# EAGLE schematic Sensor module (EAGLE 9.3.1)
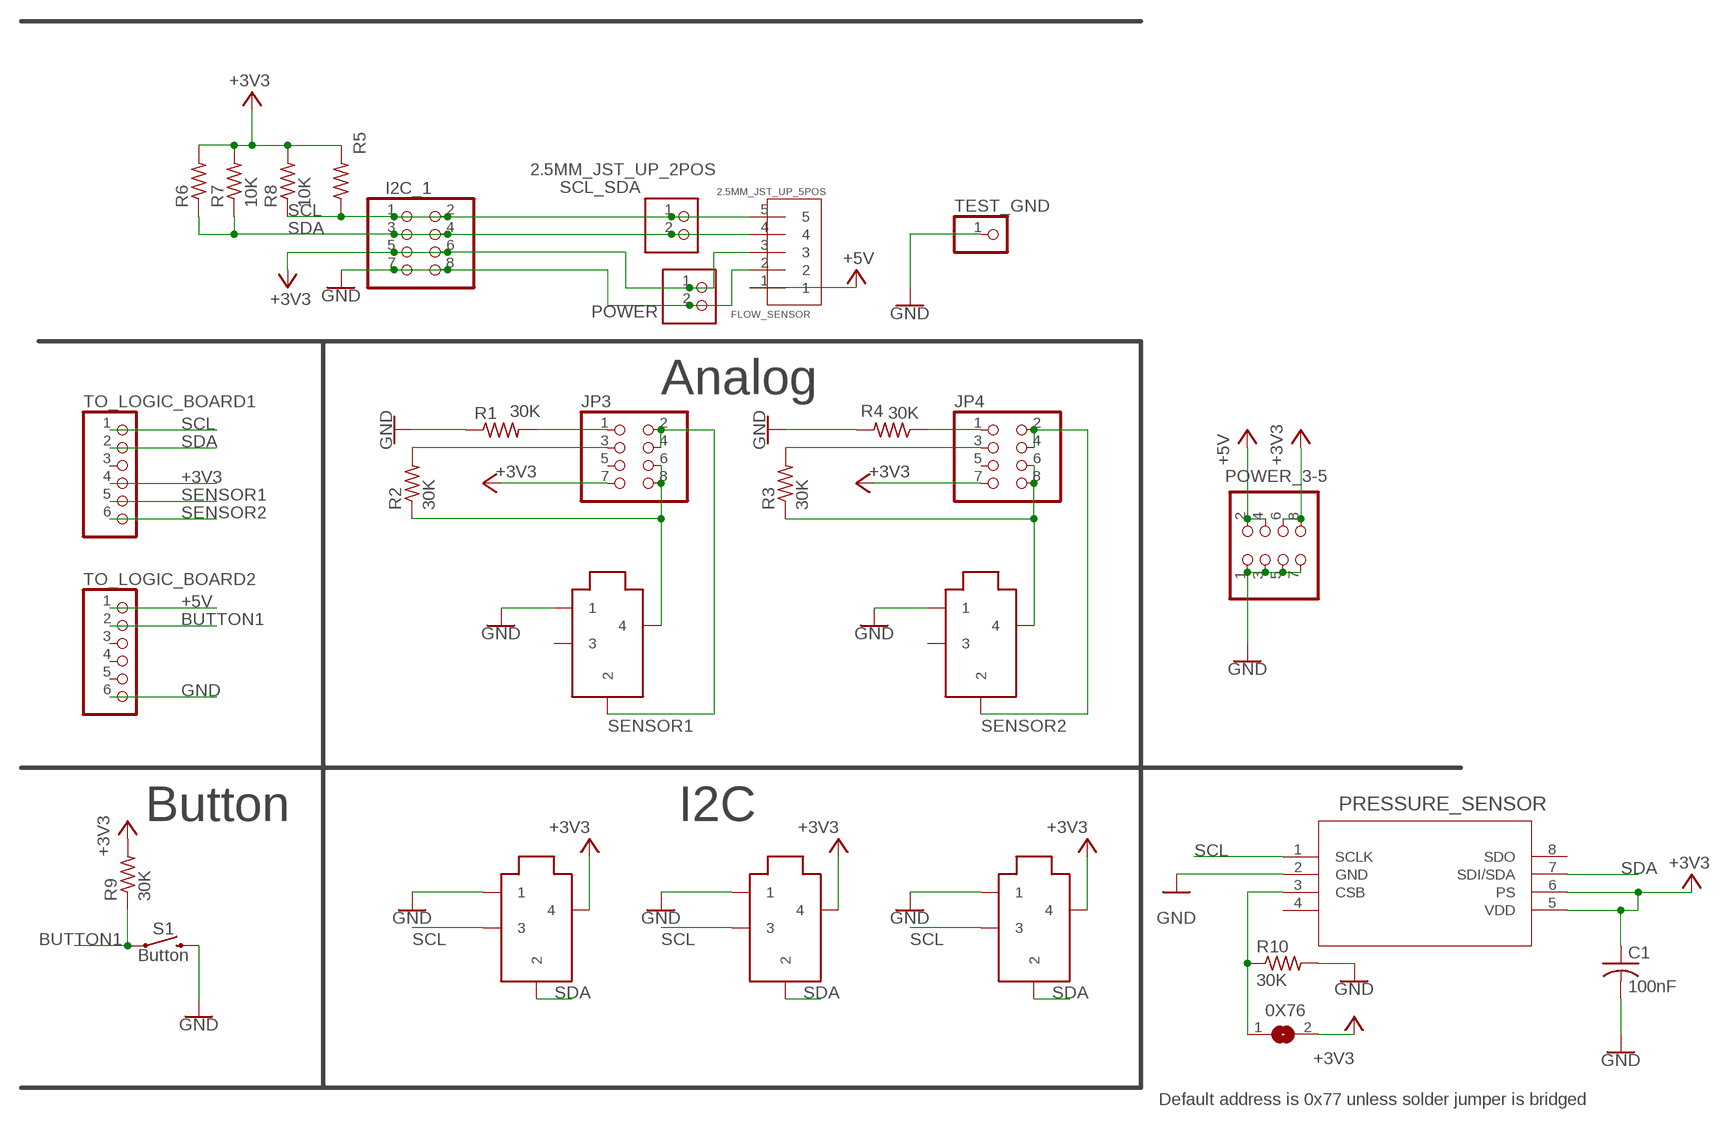
[diagram p0: schematic, sheet 1]

## Parts
0X76  SJ  [SJ]
ANALOG1  AUDIOJACK_2.5MM_SMD  [AJ_2.5_SMD]
ANALOG2  AUDIOJACK_2.5MM_SMD  [AJ_2.5_SMD]
C1  100nF  C-USC1206  [C1206]
FLOW_SENSOR  2.5MM_JST_UP_5POS  [JST_5POS_2.5MM_UP]
I2C_1  PINHD-2X4  [2X04]
JP3  PINHD-2X4  [2X04]
JP4  PINHD-2X4  [2X04]
POWER  2.5MM_JST_UP_2POS  [JST_2POS_2.5MM_UP]
POWER_3-5  PINHD-2X4  [2X04]
PRESSURE_SENSOR  MS580302BA01-00  [MS5803-02BA01]
R1  30K  R-US_R1206  [R1206]
R2  30K  R-US_R1206  [R1206]
R3  30K  R-US_R1206  [R1206]
R4  30K  R-US_R1206  [R1206]
R5  R-US_R1206  [R1206]
R6  R-US_R1206  [R1206]
R7  10K  R-US_0204/7  [0204/7]
R8  10K  R-US_0204/7  [0204/7]
R9  30K  R-US_R1206  [R1206]
R10  30K  R-US_R1206  [R1206]
S1  Button  MOMENTARY-SWITCH-SPST-PTH-6.0MM  [TACTILE_SWITCH_PTH_6.0MM]
SCL_SDA  2.5MM_JST_UP_2POS  [JST_2POS_2.5MM_UP]
TEST_GND  PINHD-1X1  [1X01]
TO_LOGIC_BOARD1  PINHD-1X6CB  [1X06-CLEANBIG]
TO_LOGIC_BOARD2  PINHD-1X6CB  [1X06-CLEANBIG]
U$1  I2C  AUDIOJACK_2.5MM_SMD  [AJ_2.5_SMD]
U$2  I2C  AUDIOJACK_2.5MM_SMD  [AJ_2.5_SMD]
U$5  I2C  AUDIOJACK_2.5MM_SMD  [AJ_2.5_SMD]

## Nets
+3V3: 0X76.2 C1.1 FLOW_SENSOR.3 I2C_1.5 I2C_1.6 JP3.7 JP4.7 POWER.1 POWER_3-5.6 POWER_3-5.8 PRESSURE_SENSOR.5(VDD) PRESSURE_SENSOR.6(PS) R5.2 R6.2 R7.2 R8.2 R9.2 TO_LOGIC_BOARD1.4 U$1.4 U$2.4 U$5.4
+5V: FLOW_SENSOR.1 POWER_3-5.2 POWER_3-5.4 TO_LOGIC_BOARD2.1
BUTTON1: R9.1 S1.1 TO_LOGIC_BOARD2.2
GND: ANALOG1.1 ANALOG2.1 C1.2 FLOW_SENSOR.2 I2C_1.7 I2C_1.8 POWER.2 POWER_3-5.1 POWER_3-5.3 POWER_3-5.5 POWER_3-5.7 PRESSURE_SENSOR.2(GND) R1.1 R4.2 R10.2 S1.3 TEST_GND.1 TO_LOGIC_BOARD2.6 U$1.1 U$2.1 U$5.1
N$1: 0X76.1 PRESSURE_SENSOR.3(CSB) R10.1
N$3: ANALOG1.4 JP3.6 JP3.8 R2.1
N$4: JP3.3 R2.2
N$5: JP3.1 R1.2
N$6: JP4.3 R3.2
N$7: ANALOG2.4 JP4.6 JP4.8 R3.1
N$8: JP4.1 R4.1
SCL: FLOW_SENSOR.5 I2C_1.1 I2C_1.2 PRESSURE_SENSOR.1(SCLK) R5.1 R8.1 SCL_SDA.1 TO_LOGIC_BOARD1.1 U$1.3 U$2.3 U$5.3
SDA: FLOW_SENSOR.4 I2C_1.3 I2C_1.4 PRESSURE_SENSOR.7(SDI/SDA) R6.1 R7.1 SCL_SDA.2 TO_LOGIC_BOARD1.2 U$1.2 U$2.2 U$5.2
SENSOR1: ANALOG1.2 JP3.2 JP3.4 TO_LOGIC_BOARD1.5
SENSOR2: ANALOG2.2 JP4.2 JP4.4 TO_LOGIC_BOARD1.6
Unconnected: ANALOG1.3 ANALOG2.3 JP3.5 JP4.5 PRESSURE_SENSOR.4(NC) PRESSURE_SENSOR.8(SDO) TO_LOGIC_BOARD1.3 TO_LOGIC_BOARD2.3 TO_LOGIC_BOARD2.4 TO_LOGIC_BOARD2.5

## Notes on the sheet
- Analog
- Button | I2C
- Default address is 0x77 unless solder jumper is bridged

## Library data of the parts
0X76 = jumper:SJ: SMD solder JUMPER
ANALOG1 ANALOG2 U$1 U$2 U$5 = myHeaders:AUDIOJACK_2.5MM_SMD
C1 = adafruit:C-US: CAPACITOR, American symbol
FLOW_SENSOR = eDNA:2.5MM_JST_UP_5POS: 2.5MM JST 5POS, 5 Position, up https://www.digikey.com/product-detail/en/jst-sales-america-inc/B5B-XH-A-LF-SN/455-2270-ND/1530483
I2C_1 JP3 JP4 POWER_3-5 = adafruit:PINHD-2X4: PIN HEADER
POWER SCL_SDA = eDNA:2.5MM_JST_UP_2POS
PRESSURE_SENSOR = eDNA:MS580302BA01-00: Pressure sensor https://www.digikey.com/product-detail/en/te-connectivity-measurement-specialties/MS580302BA01-00/223-1624-5-ND/5277629; MANUFACTURER_PART_NUMBER: MS580302BA0100; VENDOR: TE Connectivity
R1-R10 = adafruit:R-US_: RESISTOR, American symbol
S1 = SparkFun-Switches:MOMENTARY-SWITCH-SPST: Momentary Switch (Pushbutton) - SPST Normally-open (NO) SPST momentary switches (buttons, pushbuttons). Variants PTH-12MM - 12mm square, through-hole Momentary Pushbutton Switch - 12mm Square <https://www.sparkfun.com/products/9190> (COM-09190) PTH-6.0MM, PTH-6.0MM-KIT - 6.0mm square, through-hole Mini Pushbutton Switch <https://www.sparkfun.com/products/97> (COM-00097) KIT package intended for soldering kit's - only one side of pads' copper is exposed. PTH-RIGHT-ANGLE-KIT - Right-angle, through-hole Right Angle Tactile Button <https://www.sparkfun.com/products/10791> - Used on SparkFun BigTime Watch Kit <https://www.sparkfun.com/products/11734> SMD-12MM - 12mm square, surface-mount Tactile Button - SMD (12mm) <https://www.sparkfun.com/products/12993> (COM-12993) Used on SparkFun PicoBoard <https://www.sparkfun.com/products/11888> SMD-4.5MM - 4.5mm Square Trackball Switch Used on SparkFun Blackberry Trackballer Breakout <https://www.sparkfun.com/products/13169> SMD-4.6MMX2.8MM - 4.60mm x 2.80mm, surface mount Used on SparkFun SAMD21 Mini Breakout <https://www.sparkfun.com/products/13664> SMD-5.2MM, SMD-5.2-REDUNDANT - 5.2mm square, surface-mount Mini Pushbutton Switch - SMD <https://www.sparkfun.com/products/8720> (COM-08720) Used on Arduino Pro Mini <https://www.sparkfun.com/products/11114> REDUNDANT package connects both switch circuits together SMD-6.0X3.5MM - 6.0 x 3.5mm, surface mount Momentary Reset Switch SMD <https://www.sparkfun.com/products/8229> (COM-08229) SMD-6.2MM-TALL - 6.2mm square, surface mount Tactile Button - SMD (6mm) <https://www.sparkfun.com/products/12992> Used on SparkFun Digital Sandbox <https://www.sparkfun.com/products/12651> SMD-RIGHT-ANGLE - Right-angle, surface mount Used on SparkFun Block for Intel® Edison - Arduino <https://www.sparkfun.com/products/13036>; PROD_ID: SWCH-08441; SF_SKU: COM-00097
TEST_GND = adafruit:PINHD-1X1: Pin header 1x1 for 0.1" spacing With round pins
TO_LOGIC_BOARD1 TO_LOGIC_BOARD2 = adafruit:PINHD-1X6: PIN HEADER